# Altium schematic sheet 1712.SchDoc
size A4
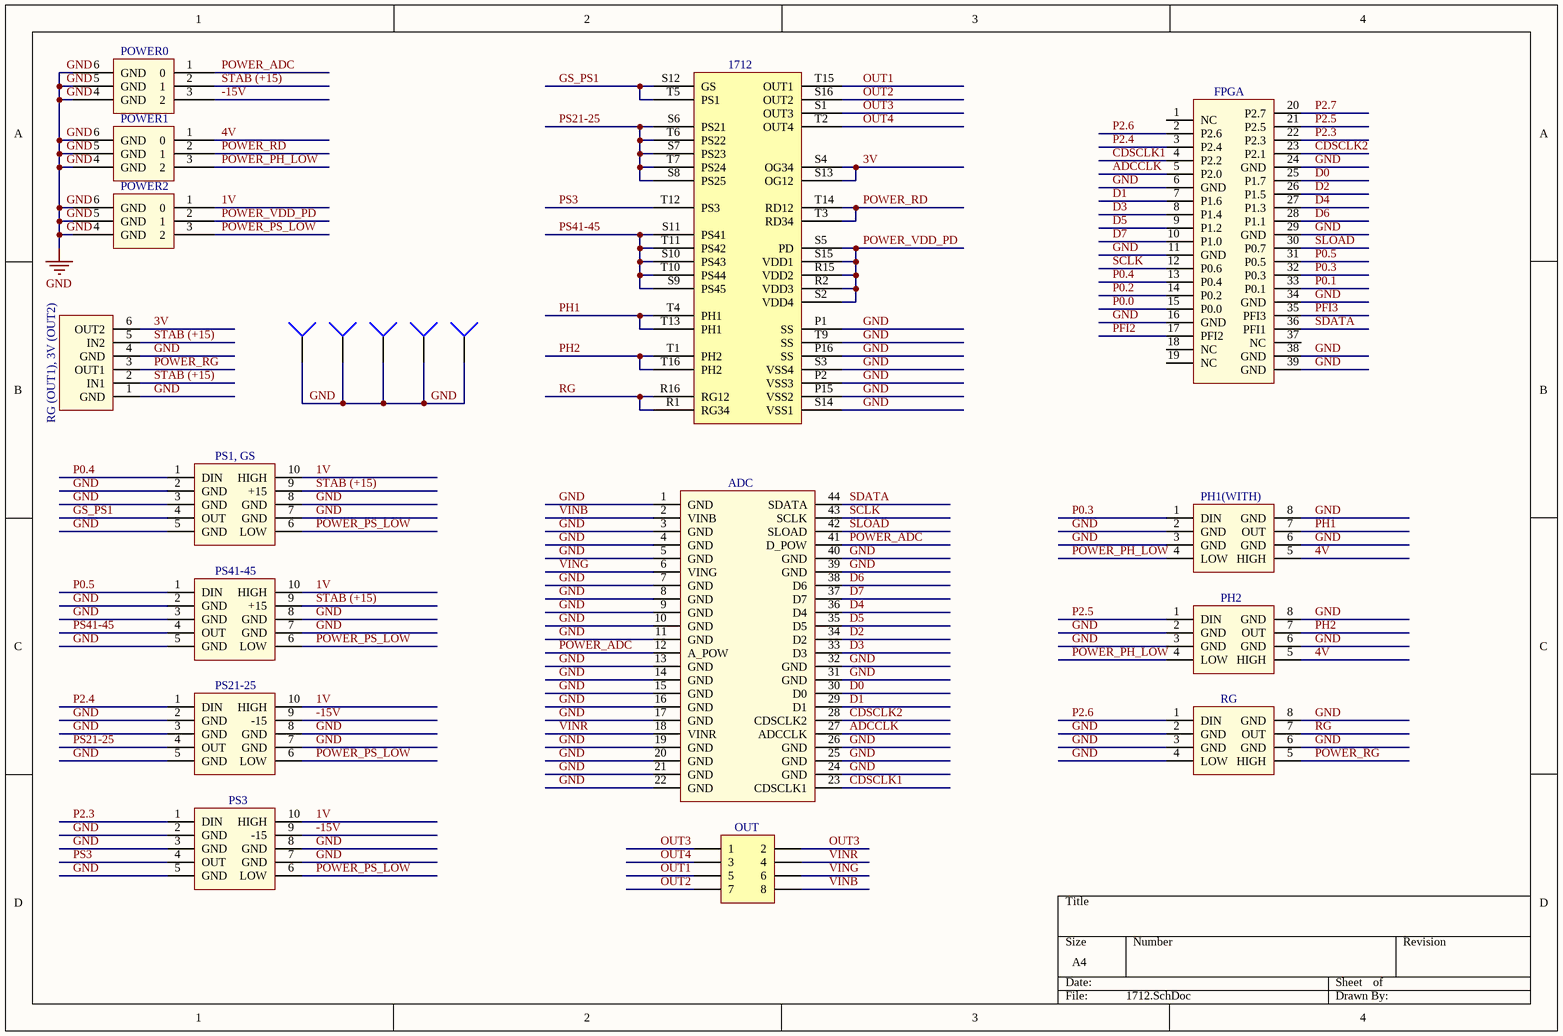
[diagram p0: 1712.SchDoc]

## Parts
1712  Б1712А-3  [Dzr_place]  (value not drawn)
ADC  MEZON_ADC  [MEZON_ADC]  (value not drawn)
FPGA  CHEAP_CON_37_FEMALE  [CHEAP_CONN_FEMALE]  (value not drawn)
J1  Socket  [PIN1]  (value not drawn)
J2  Socket  [PIN1]  (value not drawn)
J3  Socket  [PIN1]  (value not drawn)
J4  Socket  [PIN1]  (value not drawn)
J5  Socket  [PIN1]  (value not drawn)
OUT  Header 4X2  [HDR2X4]  (value not drawn)
PH1(WITH)  MEZON_H  [MEZON_H]  (value not drawn)
PH2  MEZON_H  [MEZON_H]  (value not drawn)
POWER0  POWER  [POWER]  (value not drawn)
POWER1  POWER  [POWER]  (value not drawn)
POWER2  POWER  [POWER]  (value not drawn)
PS1,_GS  MEZON_V+15  [MEZON_V]  (value not drawn)
PS3  MEZON_V  [MEZON_V]  (value not drawn)
PS21-25  MEZON_V  [MEZON_V]  (value not drawn)
PS41-45  MEZON_V+15  [MEZON_V]  (value not drawn)
RG  MEZON_H  [MEZON_H]  (value not drawn)
RG_(OUT1),_3V_(OUT2)  MEZ_POWER  [MEZON_POWER_NEW]  (value not drawn)

## Nets
GND: 1712.P1(SS) 1712.P2(VSS3) 1712.P15(VSS2) 1712.P16(SS) 1712.S3(VSS4) 1712.S14(VSS1) 1712.T9(SS) ADC.1(GND) ADC.3(GND) ADC.4(GND) ADC.5(GND) ADC.7(GND) ADC.8(GND) ADC.9(GND) ADC.10(GND) ADC.11(GND) ADC.13(GND) ADC.14(GND) ADC.15(GND) ADC.16(GND) ADC.17(GND) ADC.19(GND) ADC.20(GND) ADC.21(GND) ADC.22(GND) ADC.24(GND) ADC.25(GND) ADC.26(GND) ADC.31(GND) ADC.32(GND) ADC.39(GND) ADC.40(GND) FPGA.6(GND) FPGA.11(GND) FPGA.16(GND) FPGA.24(GND) FPGA.29(GND) FPGA.34(GND) FPGA.38(GND) FPGA.39(GND) J1.1 J2.1 J3.1 J4.1 J5.1 PH1(WITH).2(GND) PH1(WITH).3(GND) PH1(WITH).6(GND) PH1(WITH).8(GND) PH2.2(GND) PH2.3(GND) PH2.6(GND) PH2.8(GND) POWER0.4(GND) POWER0.5(GND) POWER0.6(GND) POWER1.4(GND) POWER1.5(GND) POWER1.6(GND) POWER2.4(GND) POWER2.5(GND) POWER2.6(GND) PS1,_GS.2(GND) PS1,_GS.3(GND) PS1,_GS.5(GND) PS1,_GS.7(GND) PS1,_GS.8(GND) PS3.2(GND) PS3.3(GND) PS3.5(GND) PS3.7(GND) PS3.8(GND) PS21-25.2(GND) PS21-25.3(GND) PS21-25.5(GND) PS21-25.7(GND) PS21-25.8(GND) PS41-45.2(GND) PS41-45.3(GND) PS41-45.5(GND) PS41-45.7(GND) PS41-45.8(GND) RG.2(GND) RG.3(GND) RG.4(LOW) RG.6(GND) RG.8(GND) RG_(OUT1),_3V_(OUT2).1(GND) RG_(OUT1),_3V_(OUT2).4(GND)
1V: POWER2.1(0) PS1,_GS.10(HIGH) PS3.10(HIGH) PS21-25.10(HIGH) PS41-45.10(HIGH)
3V: 1712.S4(OG34) 1712.S13(OG12) RG_(OUT1),_3V_(OUT2).6(OUT2)
4V: PH1(WITH).5(HIGH) PH2.5(HIGH) POWER1.1(0)
-15V: POWER0.3(2) PS3.9(-15) PS21-25.9(-15)
ADCCLK: ADC.27(ADCCLK) FPGA.5(P2.0)
CDSCLK1: ADC.23(CDSCLK1) FPGA.4(P2.2)
CDSCLK2: ADC.28(CDSCLK2) FPGA.23(P2.1)
D0: ADC.30(D0) FPGA.25(P1.7)
D1: ADC.29(D1) FPGA.7(P1.6)
D2: ADC.34(D2) FPGA.26(P1.5)
D3: ADC.33(D3) FPGA.8(P1.4)
D4: ADC.36(D4) FPGA.27(P1.3)
D5: ADC.35(D5) FPGA.9(P1.2)
D6: ADC.38(D6) FPGA.28(P1.1)
D7: ADC.37(D7) FPGA.10(P1.0)
GS_PS1: 1712.S12(GS) 1712.T5(PS1) PS1,_GS.4(OUT)
OUT1: 1712.T15(OUT1) OUT.5
OUT2: 1712.S16(OUT2) OUT.7
OUT3: 1712.S1(OUT3) OUT.1 OUT.2
OUT4: 1712.T2(OUT4) OUT.3
P0.0: FPGA.15(P0.0)
P0.1: FPGA.33(P0.1)
P0.2: FPGA.14(P0.2)
P0.3: FPGA.32(P0.3) PH1(WITH).1(DIN)
P0.4: FPGA.13(P0.4) PS1,_GS.1(DIN)
P0.5: FPGA.31(P0.5) PS41-45.1(DIN)
P2.3: FPGA.22(P2.3) PS3.1(DIN)
P2.4: FPGA.3(P2.4) PS21-25.1(DIN)
P2.5: FPGA.21(P2.5) PH2.1(DIN)
P2.6: FPGA.2(P2.6) RG.1(DIN)
P2.7: FPGA.20(P2.7)
PFI2: FPGA.17(PFI2)
PFI3: FPGA.35(PFI3)
PH1: 1712.T4(PH1) 1712.T13(PH1) PH1(WITH).7(OUT)
PH2: 1712.T1(PH2) 1712.T16(PH2) PH2.7(OUT)
POWER_ADC: ADC.12(A_POW) ADC.41(D_POW) POWER0.1(0)
POWER_PH_LOW: PH1(WITH).4(LOW) PH2.4(LOW) POWER1.3(2)
POWER_PS_LOW: POWER2.3(2) PS1,_GS.6(LOW) PS3.6(LOW) PS21-25.6(LOW) PS41-45.6(LOW)
POWER_RD: 1712.T3(RD34) 1712.T14(RD12) POWER1.2(1)
POWER_RG: RG.5(HIGH) RG_(OUT1),_3V_(OUT2).3(OUT1)
POWER_VDD_PD: 1712.R2(VDD3) 1712.R15(VDD2) 1712.S2(VDD4) 1712.S5(PD) 1712.S15(VDD1) POWER2.2(1)
PS3: 1712.T12(PS3) PS3.4(OUT)
PS21-25: 1712.S6(PS21) 1712.S7(PS23) 1712.S8(PS25) 1712.T6(PS22) 1712.T7(PS24) PS21-25.4(OUT)
PS41-45: 1712.S9(PS45) 1712.S10(PS43) 1712.S11(PS41) 1712.T10(PS44) 1712.T11(PS42) PS41-45.4(OUT)
RG: 1712.R1(RG34) 1712.R16(RG12) RG.7(OUT)
SCLK: ADC.43(SCLK) FPGA.12(P0.6)
SDATA: ADC.44(SDATA) FPGA.36(PFI1)
SLOAD: ADC.42(SLOAD) FPGA.30(P0.7)
STAB (+15): POWER0.2(1) PS1,_GS.9(+15) PS41-45.9(+15) RG_(OUT1),_3V_(OUT2).2(IN1) RG_(OUT1),_3V_(OUT2).5(IN2)
VINB: ADC.2(VINB) OUT.8
VING: ADC.6(VING) OUT.6
VINR: ADC.18(VINR) OUT.4

Not connected (* = marked no-connect by the designer): FPGA 1(NC) 18(NC) 19(NC) 37(NC)

## Library data of the parts
OUT = Header 4X2: Header, 4-Pin, Dual row; LatestRevisionDate: 17-Jul-2002; LatestRevisionNote: Re-released for DXP Platform.; Publisher: Altium Limited
PS1,_GS PS41-45 = MEZON_V_+15
RG_(OUT1),_3V_(OUT2) = MEZON_POWER_NEW
J1-J5 = Socket: LatestRevisionDate: 17-Jul-2002; LatestRevisionNote: Re-released for DXP Platform.; Publisher: Altium Limited